# EAGLE schematic ALPS_RSA0N11M9A04_Faderboard.brd (EAGLE 6.2)
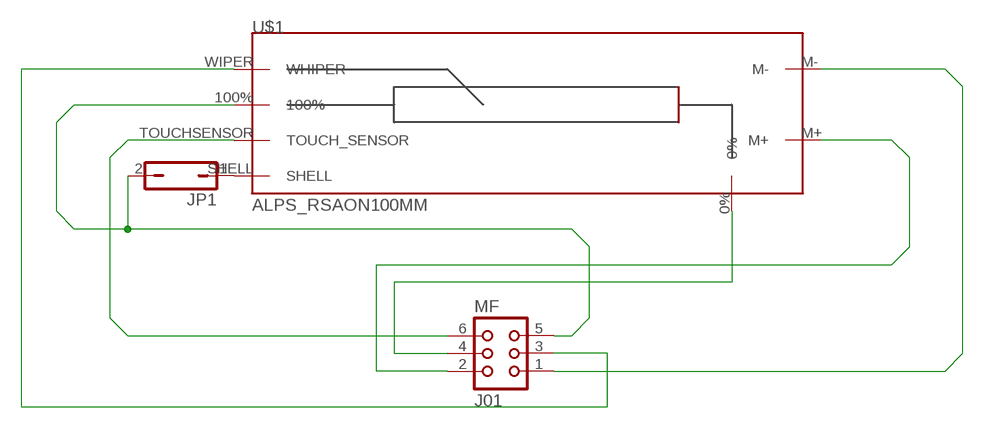
[diagram p0: schematic, sheet 1]

## Parts
JP1  JP1Q  [JP1]
MF  J01  CON06  [CON06]
U$1  ALPS_RSAON100MM  [ALPS_RAS0N_MOTOR-FADER]

## Nets
N$1: MF.1 U$1.M-
N$2: MF.2 U$1.M+
N$3: MF.3 U$1.WIPER(WHIPER)
N$4: MF.4 U$1.0%
N$5: JP1.2 MF.5 U$1.100%
N$6: MF.6 U$1.TOUCHSENSOR(TOUCH_SENSOR)
N$7: JP1.1 U$1.SHELL

## Library data of the parts
JP1 = jumper:JP1Q: JUMPER
MF = con-harting:CON06: CONNECTOR; OC_FARNELL: unknown; OC_NEWARK: unknown
U$1 = ALPS_RASON100:ALPS_RSAON100MM: ALPS Motorfader RSAON 100mm